# EAGLE schematic Brew-Bubbles (EAGLE 9.5.0)
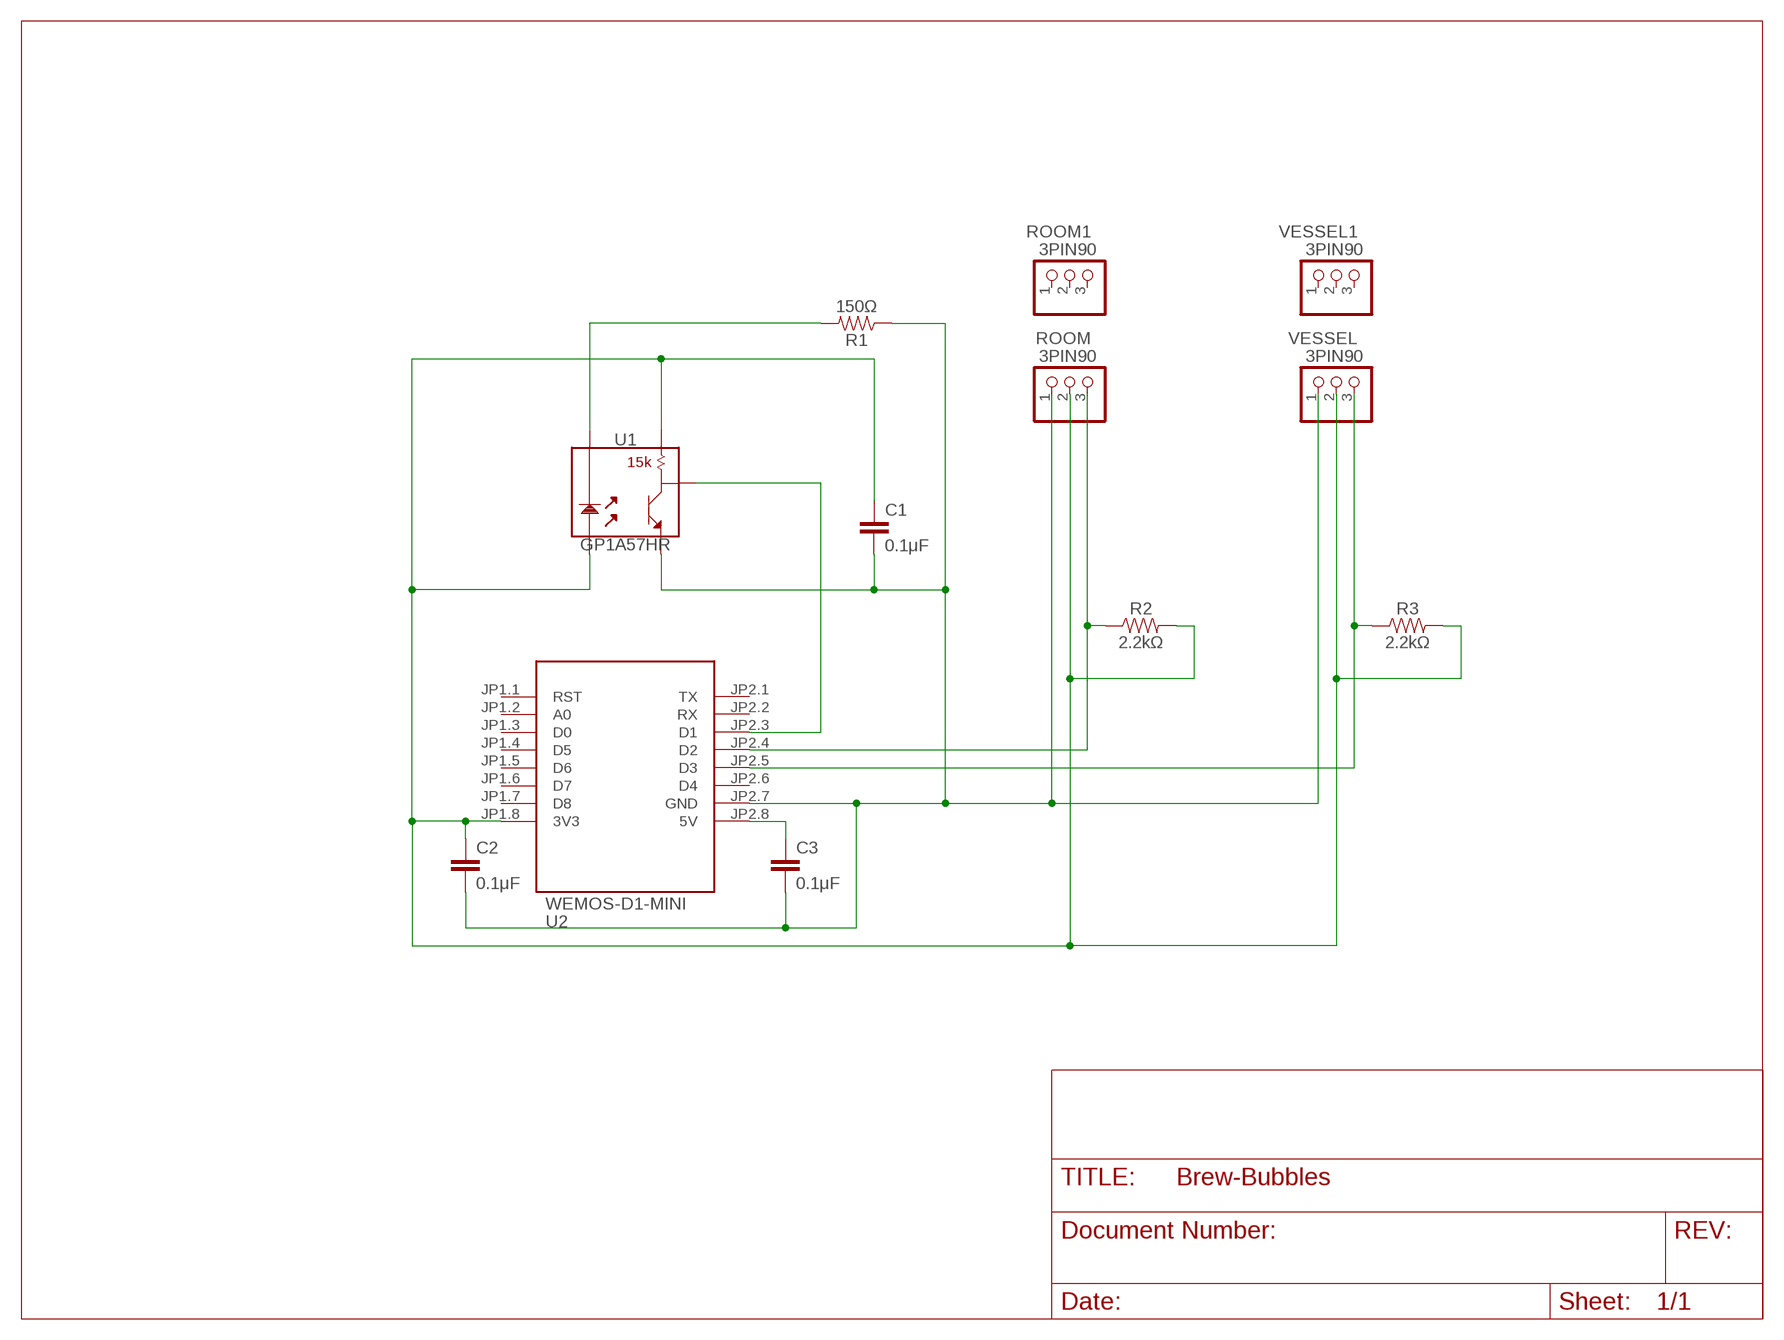
[diagram p0: schematic, sheet 1]

## Parts
C1  0.1μF  C-EU025-024X044  [C025-024X044]
C2  0.1μF  C-EU025-024X044  [C025-024X044]
C3  0.1μF  C-EU025-024X044  [C025-024X044]
R1  150Ω  330OHM-HORIZ-1/10W-5%  [AXIAL-0.3]
R2  2.2kΩ  330OHM-HORIZ-1/10W-5%  [AXIAL-0.3]
R3  2.2kΩ  330OHM-HORIZ-1/10W-5%  [AXIAL-0.3]
ROOM  3PIN90  PINHD-1X3/90  [1X03/90]
ROOM1  3PIN90  PINHD-1X3/90  [1X03/90]
U1  GP1A57HR  [GP1A57HR]
U2  WEMOS-D1-MINI  WEMOS-D1-MINI-SHIELD  [WEMOS-D1-MINI-SHIELD]
VESSEL  3PIN90  PINHD-1X3/90  [1X03/90]
VESSEL1  3PIN90  PINHD-1X3/90  [1X03/90]

## Nets
3V3: C1.1 C2.1 R2.P$2 R3.P$2 ROOM.2 U1.1 U1.3 U2.JP1.8(3V3) VESSEL.2
5V: C3.1 U2.JP2.8(5V)
D1: U1.4 U2.JP2.3(D1)
D2: R2.P$1 ROOM.3 U2.JP2.4(D2)
D3: R3.P$1 U2.JP2.5(D3) VESSEL.3
GND: C1.2 C2.2 C3.2 R1.P$1 ROOM.1 U1.5 U2.JP2.7(GND) VESSEL.1
PD1: R1.P$2 U1.2
Unconnected: ROOM1.1 ROOM1.2 ROOM1.3 U2.JP1.1(RST) U2.JP1.2(A0) U2.JP1.3(D0) U2.JP1.4(D5) U2.JP1.5(D6) U2.JP1.6(D7) U2.JP1.7(D8) U2.JP2.1(TX) U2.JP2.2(RX) U2.JP2.6(D4) VESSEL1.1 VESSEL1.2 VESSEL1.3

## Library data of the parts
C1-C3 = rcl:C-EU: CAPACITOR, European symbol; SPICEPREFIX: C
R1-R3 = SparkFun-Resistors:330OHM: 330Ω resistor A resistor is a passive two-terminal electrical component that implements electrical resistance as a circuit element. Resistors act to reduce current flow, and, at the same time, act to lower voltage levels within circuits. - Wikipedia; PROD_ID: RES-8371; VALUE: 330
ROOM ROOM1 VESSEL VESSEL1 = pinhead:PINHD-1X3: PIN HEADER
U1 = SparkFun-Sensors:GP1A57HR: Sharp GP1A57HR Transmissive Photointerrupter Standard, OPIC output, transmissive photointerrupter with opposing emitter and detector in a case, providing non-contact sensing. 10mm gap. Built in 15kΩ pull-up resistor. Datasheet <https://www.sparkfun.com/datasheets/Components/GP1A57HRJ00F.pdf> SparkFun Products Photo Interrupter - GP1A57HRJ00F <https://www.sparkfun.com/products/9299> (SEN-09299) SparkFun Photo Interrupter Breakout Board - GP1A57HRJ00F <https://www.sparkfun.com/products/9322> (BOB-09322) - Breakout board for above.; SF_ID: SEN-09299
U2 = diy-modules:WEMOS-D1-MINI-SHIELD: Template for WEMOS D1 mini compatible shields NOTICE: This is a template only. You can use it as a base to create symbols for WEMOS D1 mini compatible shields. Official list of available shields can be found here: https://www.wemos.cc/D1-mini-Shields